# Altium schematic sheet 2.SchDoc
size 420 x 297 mm
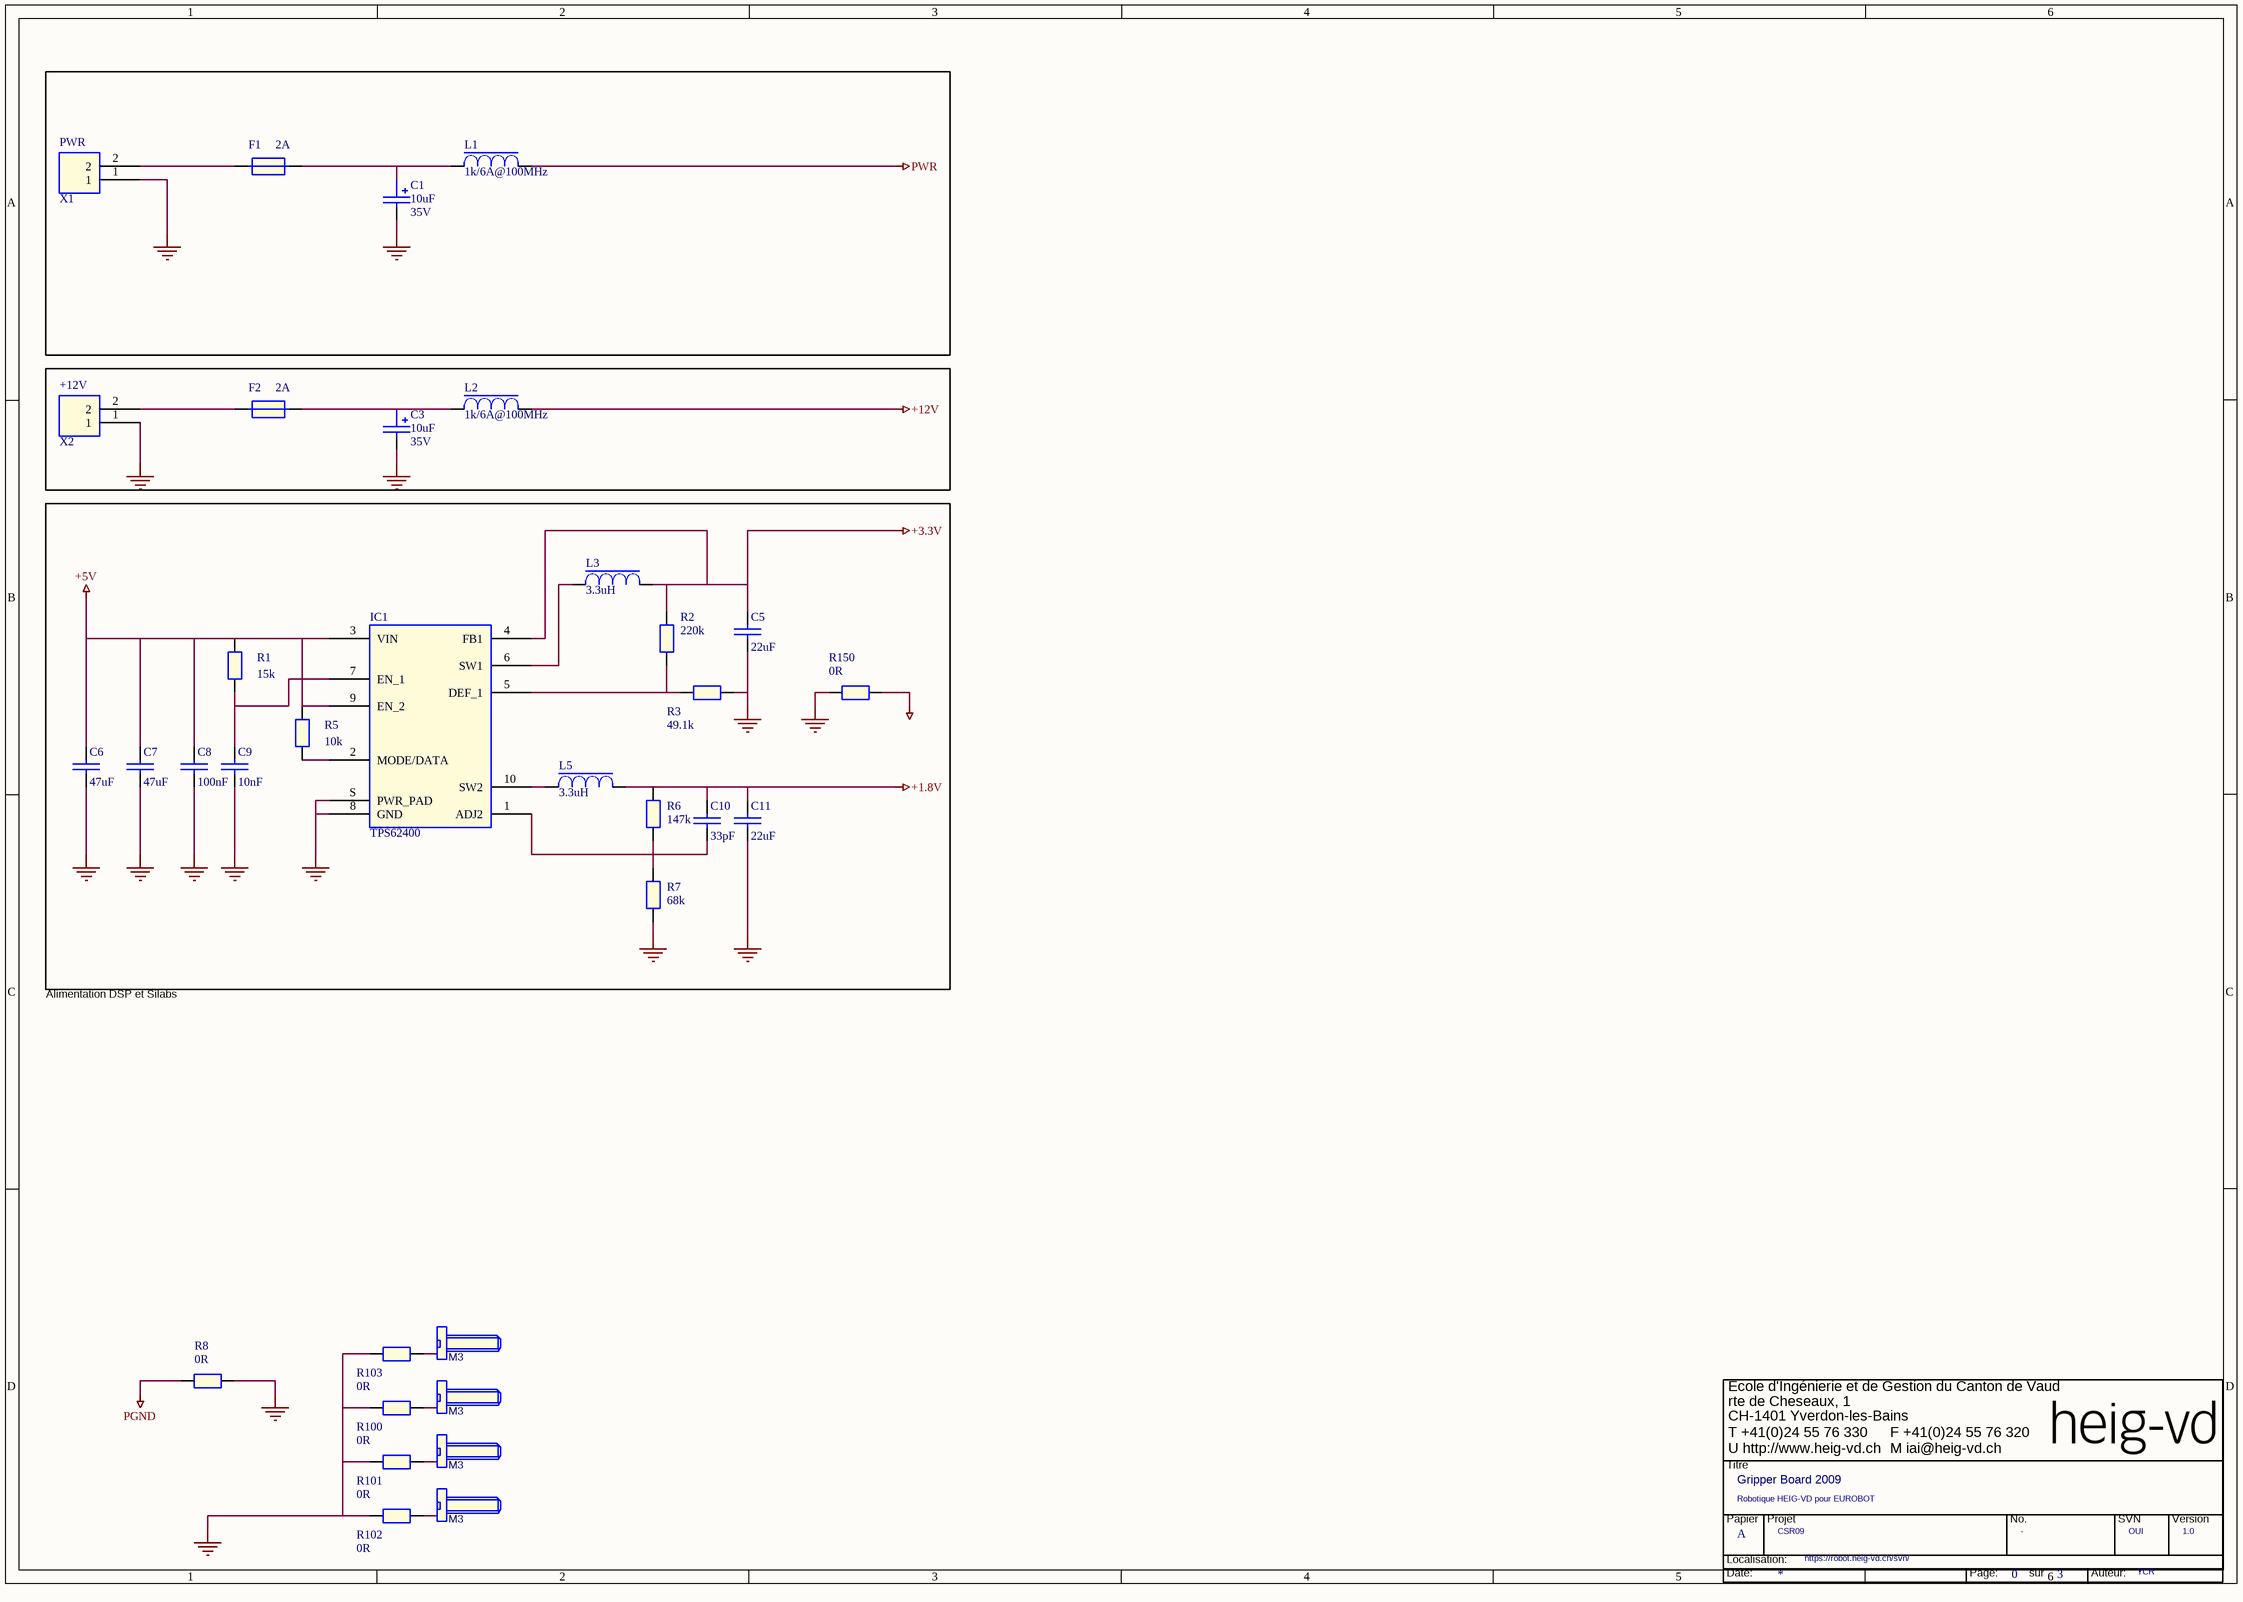
[diagram p0: 2.SchDoc]

## Parts
*  RevCode: 1.0  Title: Gripper Board 2009  Page Size: A  Page Number: 0  Page Count: 3  Projet: CSR09  Subtitle: Robotique HEIG-VD pour EUROBOT  Author: YCR  SVN: OUI  (hidden comment: TitleBlock HEIG-VD)  (graphical)
C1  10uF  Voltage: 35V  [SM/C_0805]
C3  10uF  Voltage: 35V  [SM/C_0805]
C5  22uF  [SM/C_0805]
C6  47uF  [SM/C_0805]
C7  47uF  [SM/C_0805]
C8  100nF  [SM/C_0805]
C9  10nF  [SM/C_0805]
C10  33pF  [SM/C_0805]
C11  22uF  [SM/C_0805]
F1  2A  [HEIG/LITTLEFUSE/NANO2]
F2  2A  [HEIG/LITTLEFUSE/NANO2]
H1  M3  [M3]  (value not drawn)
H2  M3  [M3]  (value not drawn)
H3  M3  [M3]  (value not drawn)
H4  M3  [M3]  (value not drawn)
IC1  TPS62400  [HEIG/TI/S-PVSON-N10]
L1  1k/6A@100MHz  [HEIG/SM/L_1210]
L2  1k/6A@100MHz  [HEIG/SM/L_1210]
L3  3.3uH  [HEIG/COILS/VLF4012A]
L5  3.3uH  [HEIG/COILS/VLF4012A]
R1  15k  [SM/R_0805]
R2  220k  [SM/R_0805]
R3  49.1k  [SM/R_0805]
R5  10k  [SM/R_0805]
R6  147k  [SM/R_0805]
R7  68k  [SM/R_0805]
R8  0R  [R400]
R100  0R  [SM/R_0805]
R101  0R  [SM/R_0805]
R102  0R  [SM/R_0805]
R103  0R  [SM/R_0805]
R150  0R  [SM/R_0805]
X1  PWR  [HEIG/PHOENIX/MC 1,5/ 2-G-3,81]
X2  +12V  [HEIG/PHOENIX/MC 1,5/ 2-G-3,81]

## Nets
+1.8V: C10.1 C11.1 L5.2 R6.2
+3.3V: C5.1 IC1.4(FB1) L3.2 R2.2
+5V: C6.1 C7.1 C8.1 IC1.3(VIN) IC1.9(EN_2) R1.2 R5.2
+12V: L2.2
AGND: R150.2
GND: C1.2 C3.2 C5.2 C6.2 C7.2 C8.2 C9.2 C11.2 IC1.8(GND) IC1.S(PWR_PAD) R3.2 R7.1 R8.2 R100.1 R101.1 R102.1 R103.1 R150.1 X1.1 X2.1
PGND: R8.1
PWR: L1.2
NetC1_1: C1.1 F1.2 L1.1
NetC3_1: C3.1 F2.2 L2.1
NetC9_1: C9.1 IC1.7(EN_1) R1.1
NetC10_2: C10.2 IC1.1(ADJ2) R6.1 R7.2
NetF1_1: F1.1 X1.2
NetF2_1: F2.1 X2.2
NetH1_1: H1.1(EARTH) R103.2
NetH2_1: H2.1(EARTH) R100.2
NetH3_1: H3.1(EARTH) R101.2
NetH4_1: H4.1(EARTH) R102.2
NetIC1_2: IC1.2(MODE/DATA) R5.1
NetIC1_5: IC1.5(DEF_1) R2.1 R3.1
NetIC1_6: IC1.6(SW1) L3.1
NetIC1_10: IC1.10(SW2) L5.1

## Notes on the sheet
- Alimentation DSP et Silabs
- (in symbol TitleBlock HEIG-VD) Ecole d'Ingénierie et de Gestion du Canton de Vaud; rte de Cheseaux, 1; CH-1401 Yverdon-les-Bains; T +41(0)24 55 76 330; F +41(0)24 55 76 320; U http://www.heig-vd.ch; M iai@heig-vd.ch; Titre; Papier; Projet; No.; SVN; Version; Localisation:; Date:; Page:; sur; Auteur:

## Library data of the parts
* = TitleBlock HEIG-VD: OrgName: Yves Chevallier; OrgAddr1: Ecole d'Ingenierie et du Canton de Vaud; OrgAddr2: route de Cheseaux, 1; OrgAddr3: 1400 Yverdon-les-Bains; Page Create Date: March  8, 1995; No Projet: -; Location: https://robot.heig-vd.ch/svn/; Page Modify Date: *
C1 = C+: PCB Footprint: HEIG/SM/CT_7343; Prix: 2.85; Ref. Fabricant: AVX TPSD106K035R0125; Quantité min: 1; Fabricant: AVX; Ref. Distributeur: 1135215; Distributeur: Farnell; REF DISTRIBUTEUR: Footprint?; Manufacturer: AVX
C3 = C+: Manufacturer: AVX; PCB Footprint: HEIG/SM/CT_7343; Quantité min: 1; Ref. Fabricant: AVX TPSD106K035R0125; Prix: 2.85; Fabricant: AVX; REF DISTRIBUTEUR: Footprint?; Distributeur: Farnell; Ref. Distributeur: 1135215
C5 = C_Dup1: Quantité min: 1; Fabricant: AVX; Ref. Fab: AVXMCCTA106M006.MULTICOMP; VOLTAGE: 6.3V; Référence: 757-720; Prix Unitaire: 0.40; Prix: 1.15; Ref. Fabricant: C1206C226K9PAC; PCB Footprint: HEIG/SM/C_1206; Price in €: 0.87; Ref. Distributor: 967-014; Distributor: Farnell; Ref. Distributeur: 1288265; Distributeur: Farnell
C6 C7 = C_Dup1: Quantité min: 1; Fabricant: AVX; Ref. Fabricant: 12106D476MAT2A; Prix: 8.20; Ref. Fab: AVXMCCTA106M006.MULTICOMP; VOLTAGE: 6.3V; Référence: 757-720; Prix Unitaire: 0.40; PCB Footprint: HEIG/SM/C_1206; Ref. Distributeur: 1327743; Distributeur: Farnell; Price in €: 0.87; Ref. Distributor: 967-014; Distributor: Farnell
C8-C10 = C_Dup1: PCB Footprint: HEIG/SM/C_0603; Quantité min: 1; Ref. Fab: AVXMCCTA106M006.MULTICOMP; VOLTAGE: 10V; Référence: 757-720; Prix Unitaire: 0.40; Distributeur: Farnell; Price in €: 0.87; Ref. Distributor: 967-014; Distributor: Farnell
C11 = C_Dup1: Quantité min: 1; Fabricant: AVX; Ref. Fabricant: C1206C226K9PAC; Prix: 1.15; Ref. Fab: AVXMCCTA106M006.MULTICOMP; VOLTAGE: 6.3V; Référence: 757-720; Prix Unitaire: 0.40; PCB Footprint: HEIG/SM/C_1206; Ref. Distributeur: 1288265; Distributeur: Farnell; Price in €: 0.87; Ref. Distributor: 967-014; Distributor: Farnell
F1 = Fusible: Fabricant: LITTELFUSE; Ref. Fabricant: 0461002T; Prix: 2.65; Voltage: 60V; Quantité min: 1; PCB Footprint: HEIG/LITTLEFUSE/NANO2; Ref. Distributeur: 1651770; Distributeur: Farnell
F2 = Fusible: Fabricant: LITTELFUSE; Ref. Fabricant: 0461002T; Prix: 2.65; Voltage: 600V; Quantité min: 1; PCB Footprint: HEIG/LITTLEFUSE/NANO2; Ref. Distributeur: 1651770; Distributeur: Farnell
H1-H4 = M3: PCB Footprint: HEIG/HOLE/M3
IC1 = TPS62400_1: Fabricant: TEXAS INSTRUMENTS; Ref. Fabricant: TPS62400DRCTG4; Prix: 11.25; Quantité min: 1; PCB Footprint: HEIG/TI/S-PVSON-N10; Ref. Distributeur: 1329597; Distributeur: Farnell
L1 L2 = L Noyau: Manufacturer: EPCOS; Prix: 0.51; Ref. Fabricant: FBMH3225HM102NT; Quantité min: 1; Fabricant: TAIYO YUDEN; Distributeur: Farnell; Ref. Distributeur: 1651731; REF DISTRIBUTEUR: Footprint?; PCB Footprint: HEIG/SM/L_1210
L3 L5 = L Noyau: Prix: 3.90; Ref. Fabricant: VLF4012AT-3R3M1R3; Fabricant: TDK; Quantité min: 1; Ref. Distributeur: 1301686; Distributeur: Farnell; PCB Footprint: HEIG/COILS/VLF4012A
R1 R2 R5 = R SMD 0805N: PCB Footprint: HEIG/SM/R_0603; Quantité min: 50; Prix: 0.064; Package: SMD 0805N; Distributeur: Farnell
R3 = R SMD 0805N: PCB Footprint: HEIG/SM/R_0603; Prix: 0.064; Quantité min: 50; Package: SMD 0805N; Distributeur: Farnell
R6 = R SMD 0805N: PCB Footprint: HEIG/SM/R_0603; Quantité min: 50; Fabricant: MULTICOMP; Ref. Fabricant: MC 0.063W 0603 1% 147K; Prix: 0.064; Package: SMD 0805N; Ref. Distributeur: 1171002; Distributeur: Farnell
R7 = R SMD 0805N: PCB Footprint: HEIG/SM/R_0603; Quantité min: 50; Fabricant: MULTICOMP; Ref. Fabricant: MC 0.063W 0603 5% 68K; Prix: 0.064; Package: SMD 0805N; Ref. Distributeur: 9332278; Distributeur: Farnell
R8 = R_Dup3: PCB Footprint: HEIG/SM/R_0805; Ref. Fabricant: MC 0.063W 0603 1% 10K; Prix: 0.06; Quantité min: 50; Fabricant: MULTICOMP; Ref. Distributeur: 9330399; Distributeur: Farnell
R100-R103 = R SMD 0805N: Prix: 0.064; Quantité min: 50; PCB Footprint: HEIG/SM/R_0805; Package: SMD 0805N; Distributeur: Farnell
R150 = R SMD 0805N: Prix: 0.064; Quantité min: 50; PCB Footprint: HEIG/SM/R_0603; Package: SMD 0805N; Distributeur: Farnell
X1 X2 = Connecteur 02: PCB Footprint: HEIG/PHOENIX/MC 1,5/ 2-G-3,81